# Altium schematic sheet BaseStation.SchDoc
size A2; SheetNumber: 1; SheetTotal: 1
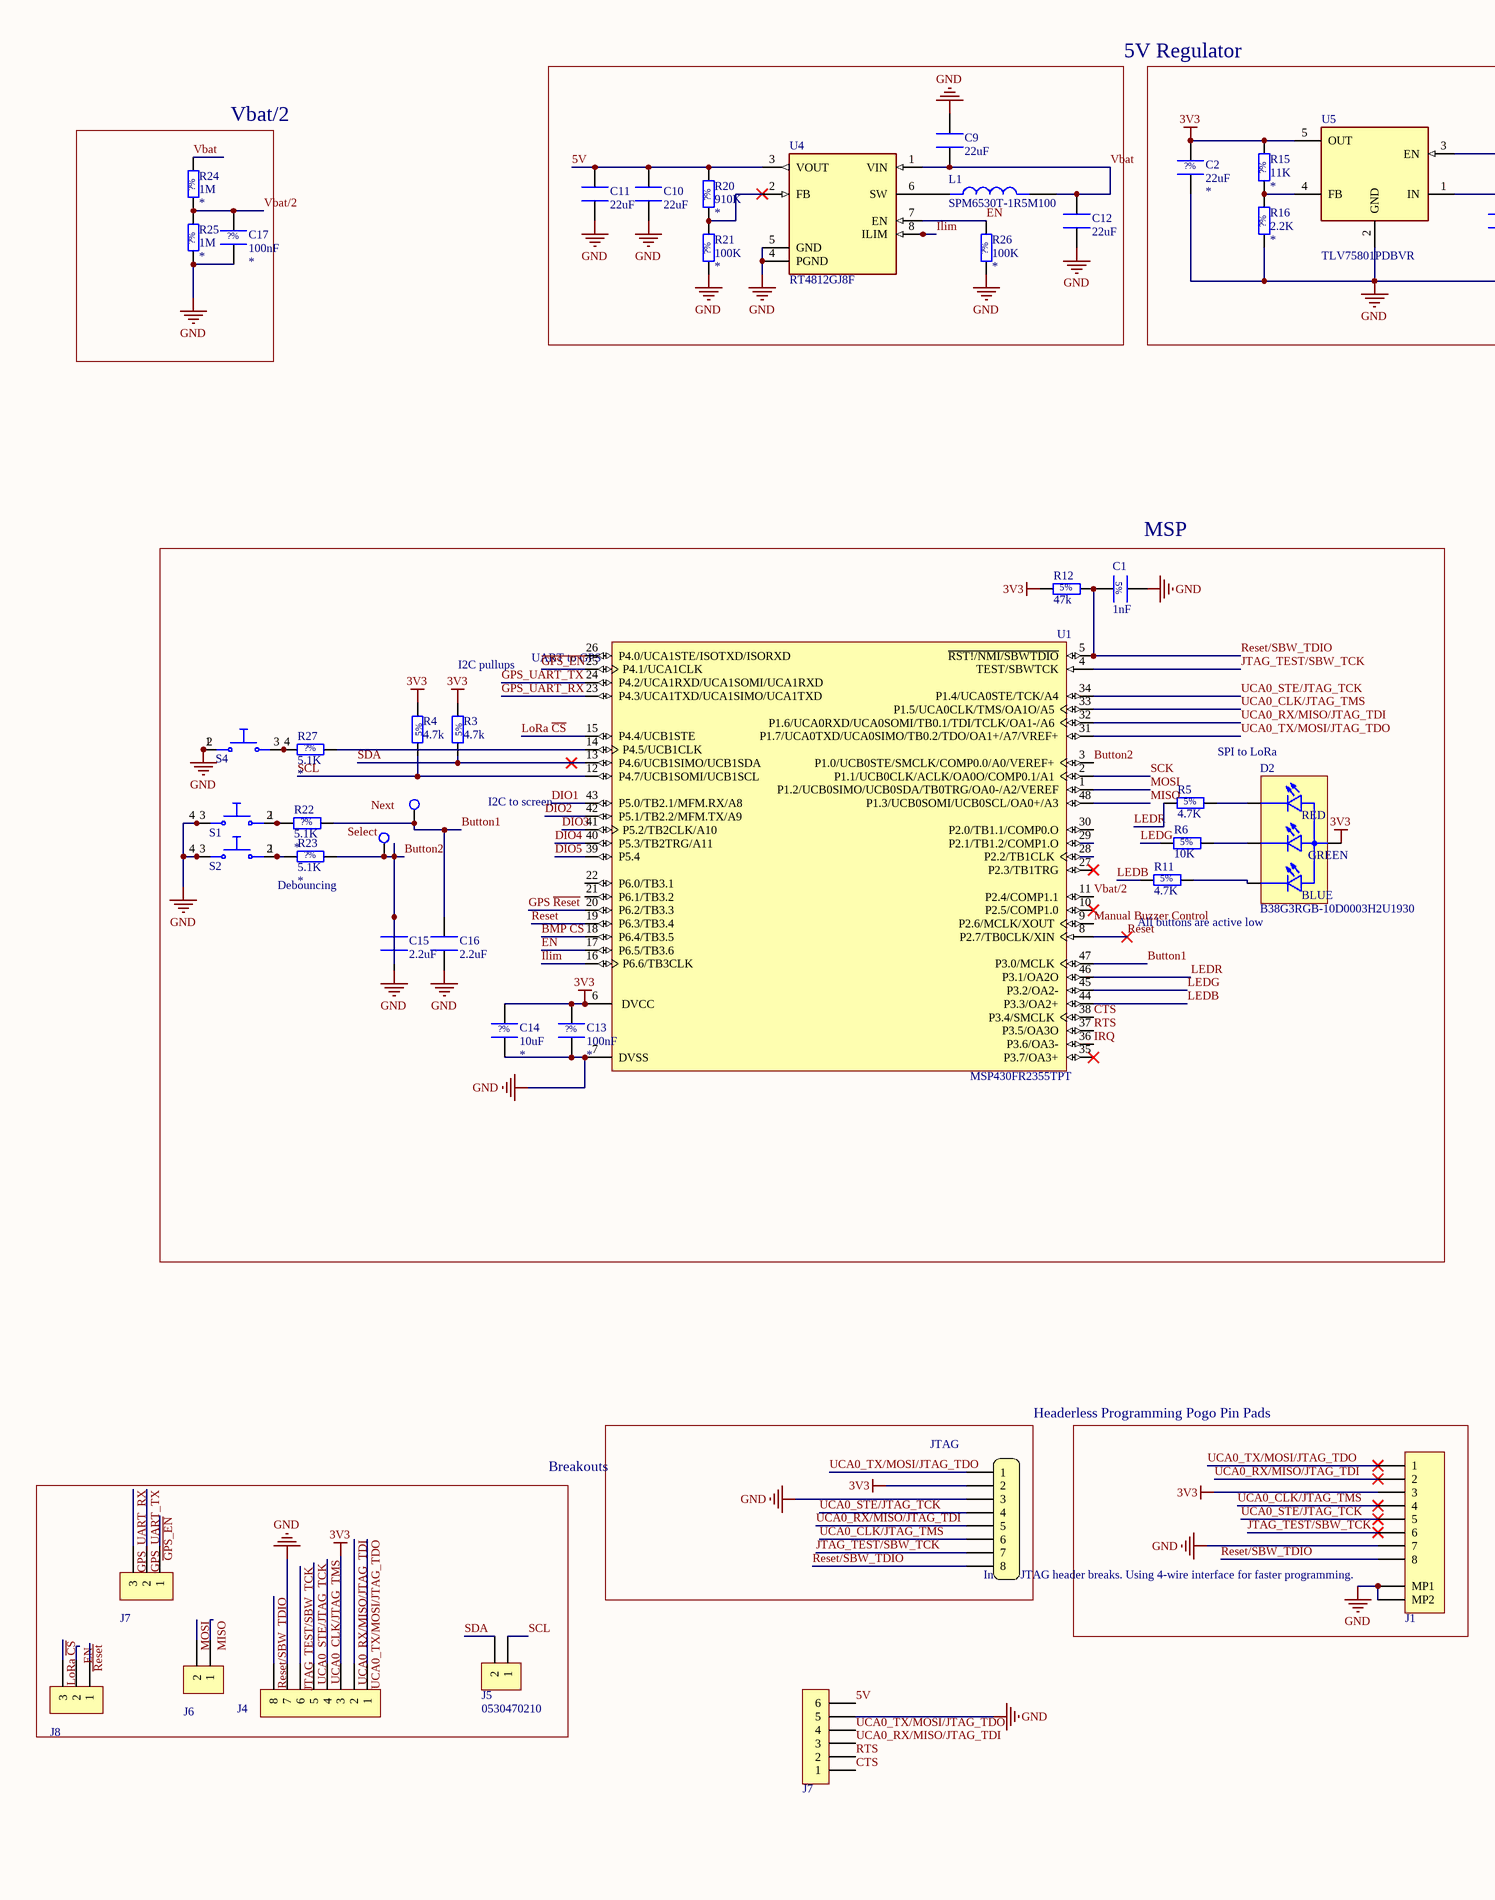
[diagram p0: BaseStation.SchDoc, left]
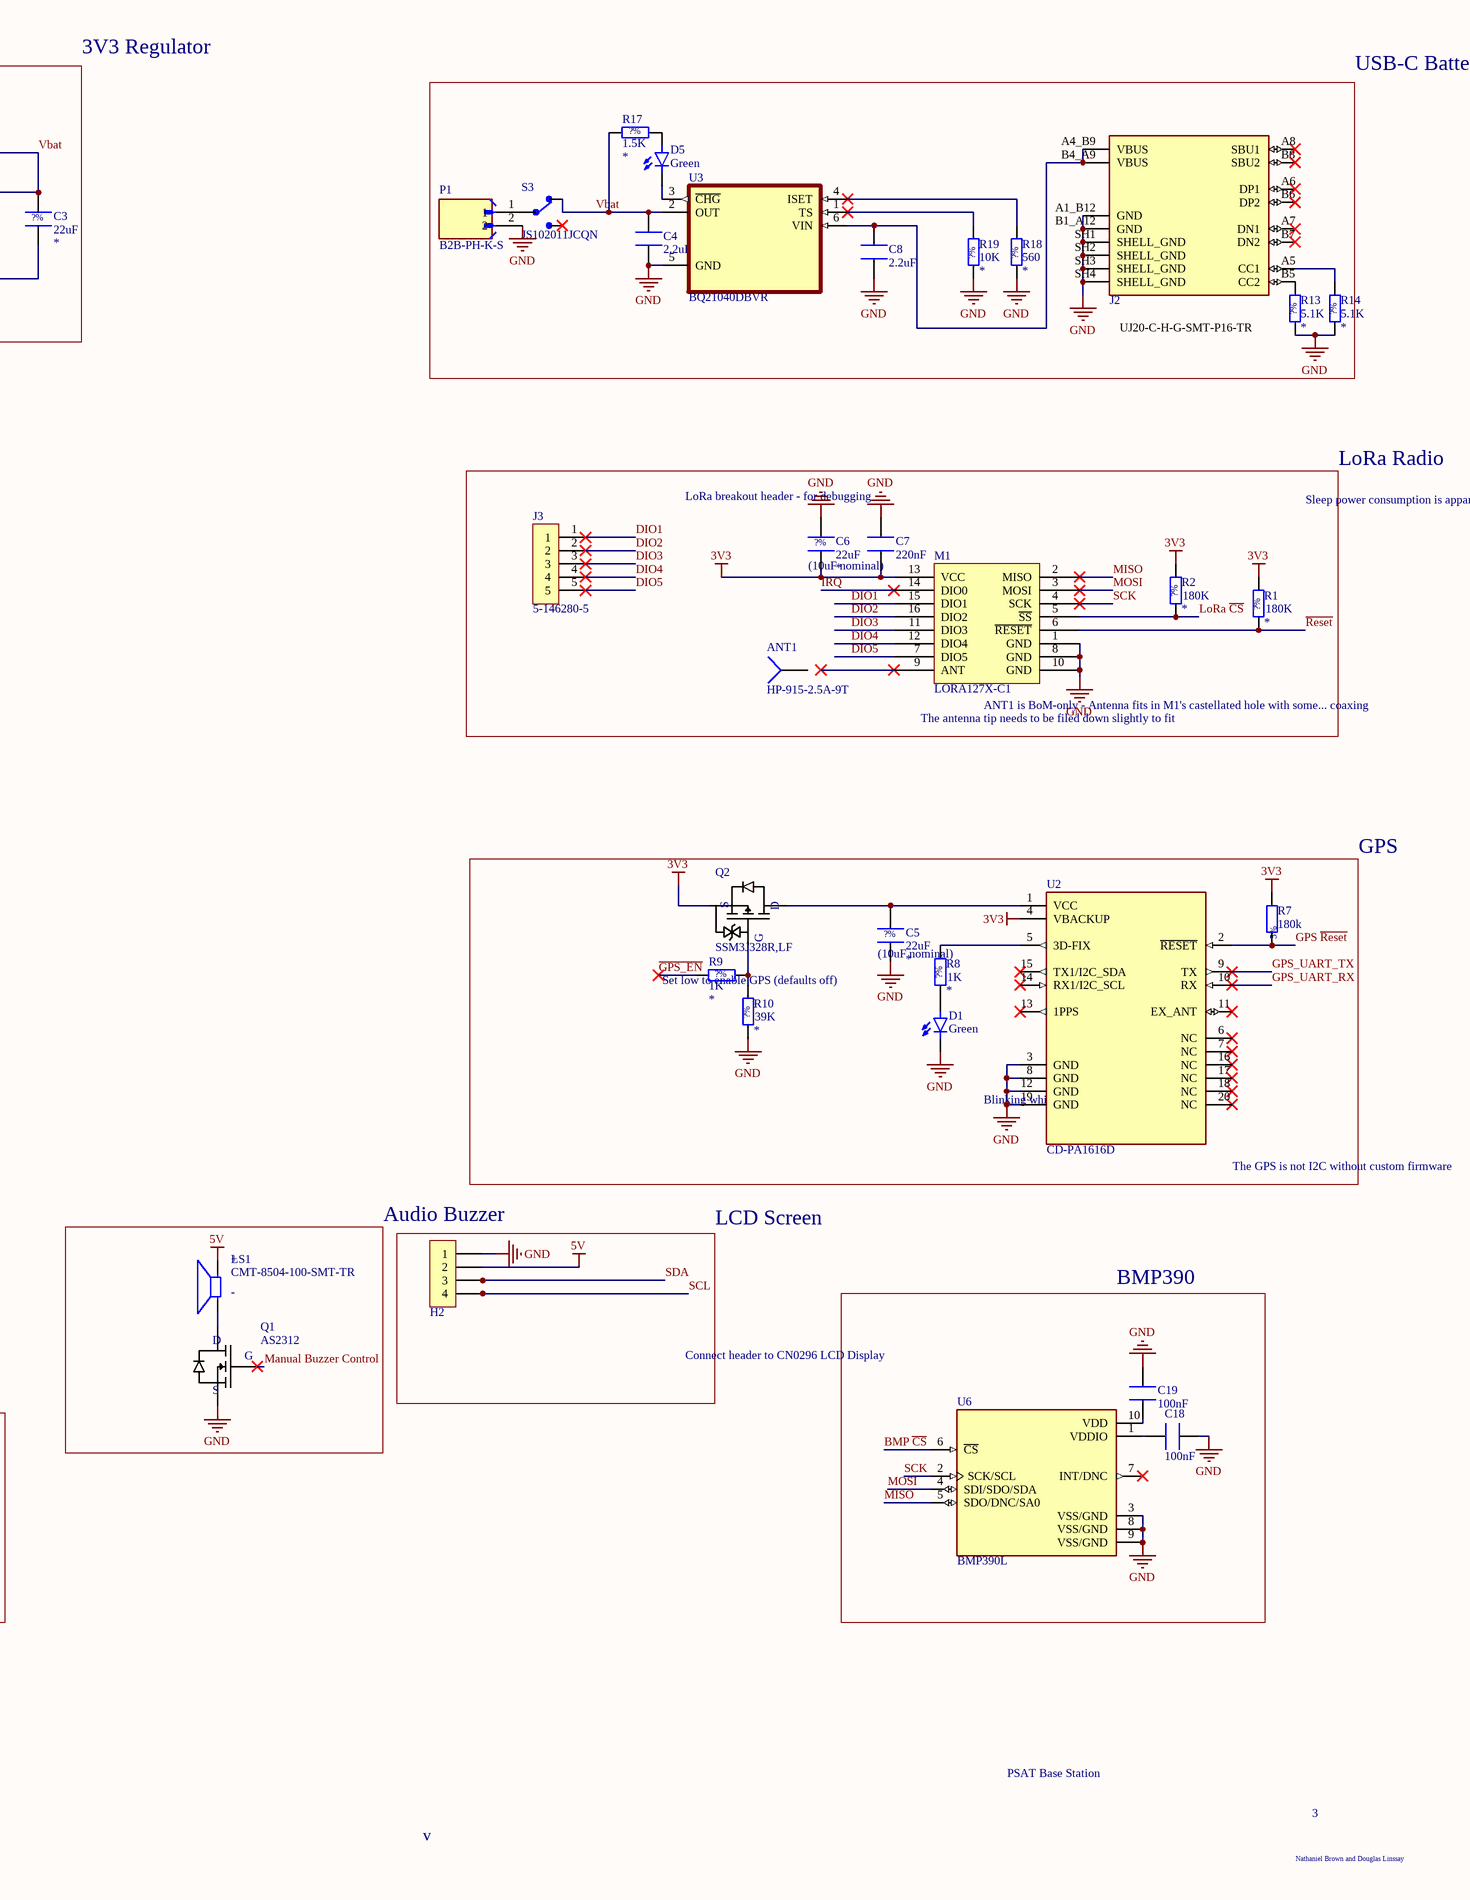
[diagram p1: BaseStation.SchDoc, right]

## Parts
(Parts that share a designator on the sheet are numbered #1, #2 ... from top to bottom, then left to right.)
ANT1  HP-915-2.5A-9T  (mechanical)
C1  1nF  [CAPACITOR_0805_2012M-70N]
C2  22uF  [CAPACITOR_0805_2012M-70N]
C3  22uF  [CAPACITOR_0805_2012M-70N]
C4  2.2uF  [CAPACITOR_0805_2012M-70N]
C5  22uF  [CAPACITOR_0805_2012M-70N]
C6  22uF  [CAPACITOR_0805_2012M-70N]
C7  220nF  [CAPACITOR_0805_2012M-70N]
C8  2.2uF  [CAPACITOR_0805_2012M-70N]
C9  22uF  [CAPACITOR_0805_2012M-70N]
C10  22uF  [CAPACITOR_0805_2012M-70N]
C11  22uF  [CAPACITOR_0805_2012M-70N]
C12  22uF  [CAPACITOR_0805_2012M-70N]
C13  100nF  [CAPACITOR_0805_2012M-70N]
C14  10uF  [CAPACITOR_0805_2012M-70N]
C15  2.2uF  [CAPACITOR_0805_2012M-70N]
C16  2.2uF  [CAPACITOR_0805_2012M-70N]
C17  100nF  [CAPACITOR_0805_2012M-70N]
C18  100nF  [CAPACITOR_0805_2012M-70N]
C19  100nF  [CAPACITOR_0805_2012M-70N]
D1  Colour: Green  [LED_0603_1608M_0.80mm]  (hidden comment: LTST-C190 Series)
D2  B38G3RGB-10D0003H2U1930  [LED_B38G3RGB-10D0003H2U1930_0606_1616M]
D5  Colour: Green  [LED_0603_1608M_0.80mm]  (hidden comment: LTST-C190 Series)
H1  Headerless Pogo Holes 8-pin  [POGO_8_PIN_HEADER]  (value not drawn)  (no BOM)
H2  Header - 2.54mm,1x4-pin  [HEADER_2.54MM_1x4PIN]  (value not drawn)  (no BOM)
J1  0532610871  [MOLEX_0532610871]  (value not drawn)
J2  UJ20-C-H-G-SMT-P16-TR  [SAMESKY_UJ20-C-H-G-SMT-P16-TR]  (value not drawn)
J3  5-146280-5  [TE_5-146280-5]
J4  0530470810  [MOLEX_0530470810]  (value not drawn)
J5  0530470210  [MOLEX_0530470210]
J6  0530470210  [MOLEX_0530470210]  (value not drawn)
J7#1  0530470310  [MOLEX_0530470310]  (value not drawn)
J7#2  0530470610  [MOLEX_0530470610]  (value not drawn)
J8  0530470310  [MOLEX_0530470310]  (value not drawn)
L1  SPM6530T-1R5M100  [IND_SPM6530T-1R5M100]
LS1  CMT-8504-100-SMT-TR  [XDCR_CMT-8504-100-SMT-TR]
M1  LORA127X-C1  [LoRa127X-C1]
NXT1  Test Pad  [Test Pad]  (value not drawn)  (no BOM)
P1  B2B-PH-K-S  [JST_B2B-PH-K-S]
Q1  AS2312  [SOT23-3N-1.15mm]
Q2  SSM3J328R,LF  [SOT23F-3-0.8mm]
R1  180K  [RESISTOR_0805_2012M-50N]
R2  180K  [RESISTOR_0805_2012M-50N]
R3  4.7k  [Resistor_0805_2012M-50N]
R4  4.7k  [Resistor_0805_2012M-50N]
R5  value 4.7K  [RESISTOR_0805_2012M-50N]  (hidden comment: 220)
R6  value 10K  [RESISTOR_0805_2012M-50N]  (hidden comment: 220)
R7  180k  [Resistor_0805_2012M-50N]
R8  1K  [RESISTOR_0805_2012M-50N]
R9  1K  [RESISTOR_0805_2012M-50N]
R10  39K  [RESISTOR_0805_2012M-50N]
R11  value 4.7K  [RESISTOR_0805_2012M-50N]  (hidden comment: 220)
R12  47k  [Resistor_0805_2012M-50N]
R13  5.1K  [RESISTOR_0805_2012M-50N]
R14  5.1K  [RESISTOR_0805_2012M-50N]
R15  11K  [RESISTOR_0805_2012M-50N]
R16  2.2K  [RESISTOR_0805_2012M-50N]
R17  1.5K  [RESISTOR_0805_2012M-50N]
R18  560  [RESISTOR_0805_2012M-50N]
R19  10K  [RESISTOR_0805_2012M-50N]
R20  910K  [RESISTOR_0805_2012M-50N]
R21  100K  [RESISTOR_0805_2012M-50N]
R22  5.1K  [RESISTOR_0805_2012M-50N]
R23  5.1K  [RESISTOR_0805_2012M-50N]
R24  1M  [RESISTOR_0805_2012M-50N]
R25  1M  [RESISTOR_0805_2012M-50N]
R26  100K  [RESISTOR_0805_2012M-50N]
R27  5.1K  [RESISTOR_0805_2012M-50N]
S1  PTS645SL43SMTR92LFS  [SW_PTS645SL43SMTR92LFS]  (value not drawn)
S2  PTS645SL43SMTR92LFS  [SW_PTS645SL43SMTR92LFS]  (value not drawn)
S3  JS102011JCQN  [SW_JS102011JCQN]
S4  PTS645SL43SMTR92LFS  [SW_PTS645SL43SMTR92LFS]  (value not drawn)
SEL1  Test Pad  [Test Pad]  (value not drawn)  (no BOM)
U1  MSP430FR2355TPT  [LQFP_PT_48_N]
U2  CD-PA1616D  [XCVR_CD-PA1616D]
U3  BQ21040DBVR  [SOT95P280X145-6N]
U4  RT4812GJ8F  [SOT65P279X100-8N]
U5  TLV75801PDBVR  [SOT23-5N-1.45mm]
U6  BMP390L  [XDCR_BMP390L]

## Blocks framed on the sheet
5V Regulator: C9-C12 L1 R20 R21 R26 U4
3V3 Regulator: C2 C3 R15 R16 U5
USB-C Battery Charger: C4 C8 D5 J2 P1 R13 R14 R17-R19 S3 U3
Vbat/2: C17 R24 R25
LoRa Radio: ANT1 C6 C7 J3 M1 R1 R2
MSP: C1 C13-C16 D2 NXT1 R3-R6 R11 R12 R22 R23 R27 S1 S2 S4 SEL1 U1
GPS: C5 D1 Q2 R7-R10 U2
Audio Buzzer: LS1 Q1
LCD Screen: H2
BMP390: C18 C19 U6
Headerless Programming Pogo Pin Pads: H1
Breakouts: J4-J6 J7#1 J8

## Nets
3V3: C2.2 C6.1 C7.1 C13.2 C14.2 D2.3(A) H1.2 J1.3 J4.3 M1.13(VCC) Q2.2(S) R1.2 R2.2 R3.2 R4.2 R7.2 R12.2 R15.2 U1.6(DVCC) U2.4(VBACKUP) U5.5(OUT)
5V: C10.2 C11.2 H2.2 J7#2.6 LS1.P R20.2 U4.3(VOUT)
GND: C1.1 C2.1 C3.1 C4.2 C5.1 C6.2 C7.2 C8.1 C9.2 C10.1 C11.1 C12.1 C13.1 C14.1 C15.1 C16.1 C17.1 C18.1 C19.1 D1.C H1.3 H2.1 J1.7 J1.MP1 J1.MP2 J2.A1_B12(GND) J2.B1_A12(GND) J2.SH1(SHELL_GND) J2.SH2(SHELL_GND) J2.SH3(SHELL_GND) J2.SH4(SHELL_GND) J4.7 J7#2.5 M1.1(GND) M1.8(GND) M1.10(GND) P1.2 Q1.2(S) R10.1 R13.1 R14.1 R16.1 R18.1 R19.1 R21.1 R25.1 R26.1 S1.3 S1.4 S2.3 S2.4 S4.1 S4.2(,_2) U1.7(DVSS) U2.3(GND) U2.8(GND) U2.12(GND) U2.19(GND) U3.5(GND) U4.4(PGND) U4.5(GND) U5.2(GND) U6.3(VSS/GND) U6.8(VSS/GND) U6.9(VSS/GND)
BMP ~{CS}: U1.18(P6.4/TB3.5) U6.6(~{CS})
Button1: C16.2 NXT1.1 R22.2 U1.47(P3.0/MCLK)
Button2: C15.2 R23.2 SEL1.1 U1.3(P1.0/UCB0STE/SMCLK/COMP0.0/A0/VEREF+)
CTS: J7#2.1 U1.38(P3.4/SMCLK)
DIO1: J3.1 M1.15(DIO1) U1.43(P5.0/TB2.1/MFM.RX/A8)
DIO2: J3.2 M1.16(DIO2) U1.42(P5.1/TB2.2/MFM.TX/A9)
DIO3: J3.3 M1.11(DIO3) U1.41(P5.2/TB2CLK/A10)
DIO4: J3.4 M1.12(DIO4) U1.40(P5.3/TB2TRG/A11)
DIO5: J3.5 M1.7(DIO5) U1.39(P5.4)
EN: J8.2 R26.2 U1.17(P6.5/TB3.6) U4.7(EN)
~{GPS_EN}: J7#1.1 R9.1 U1.25(P4.1/UCA1CLK)
GPS ~{Reset}: R7.1 U1.20(P6.2/TB3.3) U2.2(~{RESET})
GPS_UART_RX: J7#1.3 U1.23(P4.3/UCA1TXD/UCA1SIMO/UCA1TXD) U2.10(RX)
GPS_UART_TX: J7#1.2 U1.24(P4.2/UCA1RXD/UCA1SOMI/UCA1RXD) U2.9(TX)
Ilim: U1.16(P6.6/TB3CLK) U4.8(ILIM)
IRQ: M1.14(DIO0) U1.36(P3.6/OA3-)
JTAG_TEST/SBW_TCK: H1.7 J1.6 J4.6 U1.4(TEST/SBWTCK)
LEDB: R11.2 U1.44(P3.3/OA2+)
LEDG: R6.2 U1.45(P3.2/OA2-)
LEDR: R5.2 U1.46(P3.1/OA2O)
LoRa ~{CS}: J8.3 M1.5(~{SS}) R2.1 U1.15(P4.4/UCB1STE)
Manual Buzzer Control: Q1.1(G) U1.9(P2.6/MCLK/XOUT)
MISO: J6.1 M1.2(MISO) U1.48(P1.3/UCB0SOMI/UCB0SCL/OA0+/A3) U6.5(SDO/DNC/SA0)
MOSI: J6.2 M1.3(MOSI) U1.1(P1.2/UCB0SIMO/UCB0SDA/TB0TRG/OA0-/A2/VEREF) U6.4(SDI/SDO/SDA)
~{Reset}: J8.1 M1.6(~{RESET}) R1.1 U1.19(P6.3/TB3.4)
Reset: U1.8(P2.7/TB0CLK/XIN)
Reset/SBW_TDIO: C1.2 H1.8 J1.8 J4.8 R12.1 U1.5(~{RST!/NMI/SBWTDIO})
RTS: J7#2.2 U1.37(P3.5/OA3O)
SCK: M1.4(SCK) U1.2(P1.1/UCB0CLK/ACLK/OA0O/COMP0.1/A1) U6.2(SCK/SCL)
SCL: H2.4 J5.1 R4.1 U1.12(P4.7/UCB1SOMI/UCB1SCL)
SDA: H2.3 J5.2 R3.1 U1.13(P4.6/UCB1SIMO/UCB1SDA)
UCA0_CLK/JTAG_TMS: H1.6 J1.4 J4.4 U1.33(P1.5/UCA0CLK/TMS/OA1O/A5)
UCA0_RX/MISO/JTAG_TDI: H1.5 J1.2 J4.2 J7#2.3 U1.32(P1.6/UCA0RXD/UCA0SOMI/TB0.1/TDI/TCLK/OA1-/A6)
UCA0_STE/JTAG_TCK: H1.4 J1.5 J4.5 U1.34(P1.4/UCA0STE/TCK/A4)
UCA0_TX/MOSI/JTAG_TDO: H1.1 J1.1 J4.1 J7#2.4 U1.31(P1.7/UCA0TXD/UCA0SIMO/TB0.2/TDO/OA1+/A7/VREF+)
Vbat: C3.2 C4.1 C9.1 C12.2 L1.1 R17.1 R24.2 S3.1 U3.2(OUT) U4.1(VIN) U5.1(IN) U5.3(EN)
Vbat/2: C17.2 R24.1 R25.2 U1.11(P2.4/COMP1.1)
NetC5_2: C5.2 Q2.3(D) U2.1(VCC)
NetC8_2: C8.2 J2.A4_B9(VBUS) J2.B4_A9(VBUS) U3.6(VIN)
NetC18_2: C18.2 U6.1(VDDIO)
NetC19_2: C19.2 U6.10(VDD)
NetD1_A: D1.A R8.1
NetD2_1: D2.1(G_C) R6.1
NetD2_2: D2.2(B_C) R11.1
NetD2_4: D2.4(R_C) R5.1
NetD5_A: D5.A R17.2
NetD5_C: D5.C U3.3(~{CHG})
NetJ2_A5: J2.A5(CC1) R14.2
NetJ2_B5: J2.B5(CC2) R13.2
NetL1_2: L1.2 U4.6(SW)
NetLS1_N: LS1.N Q1.3(D)
NetP1_1: P1.1 S3.2
NetQ2_1: Q2.1(G) R9.2 R10.2
NetR8_2: R8.2 U2.5(3D-FIX)
NetR15_1: R15.1 R16.2 U5.4(FB)
NetR18_2: R18.2 U3.4(ISET)
NetR19_2: R19.2 U3.1(TS)
NetR20_1: R20.1 R21.2 U4.2(FB)
NetR22_1: R22.1 S1.1 S1.2(,_2)
NetR23_1: R23.1 S2.1 S2.2(,_2)
NetR27_1: R27.1 S4.3 S4.4
NetR27_2: R27.2 U1.14(P4.5/UCB1CLK)

Not connected (* = marked no-connect by the designer): ANT1 1; J2 A6(DP1)* A7(DN1)* A8(SBU1)* B6(DP2)* B7(DN2)* B8(SBU2)*; M1 9(ANT)*; S3 3*; U1 10(P2.5/COMP1.0)* 21(P6.1/TB3.2) 22(P6.0/TB3.1) 26(P4.0/UCA1STE/ISOTXD/ISORXD) 27(P2.3/TB1TRG)* 28(P2.2/TB1CLK) 29(P2.1/TB1.2/COMP1.O) 30(P2.0/TB1.1/COMP0.O) 35(P3.7/OA3+)*; U2 6(NC)* 7(NC)* 11(EX_ANT)* 13(1PPS)* 14(RX1/I2C_SCL)* 15(TX1/I2C_SDA)* 16(NC)* 17(NC)* 18(NC)* 20(NC)*; U6 7(INT/DNC)*

## Notes on the sheet
- UJ20-C-H-G-SMT-P16-TR
- (near J3) LoRa breakout header - for debugging
- (near C7) Sleep power consumption is apparently very low, so no enable needed
- (near C6) (10uF nominal)
- I2C pullups
- UART to GPS
- The antenna tip needs to be filed down slightly to fit
- ANT1 is BoM-only - Antenna fits in M1's castellated hole with some... coaxing
- (near NXT1) I2C to screen
- SPI to LoRa
- Debouncing
- All buttons are active low
- (near R9) Set low to enable GPS (defaults off)
- (near C5) (10uF nominal)
- Blinking while getting fix, off when fixed
- The GPS is not I2C without custom firmware
- Connect header to CN0296 LCD Display
- JTAG
- (near H1) In case JTAG header breaks. Using 4-wire interface for faster programming.
- PSAT Base Station
- v
- Nathaniel Brown and Douglas Linssay
- 3
- Labels drawn without touching a wire or pin: Next, Select
- (in symbol B38G3RGB-10D0003H2U1930) RED; GREEN; BLUE
- (in symbol CMT-8504-100-SMT-TR) +; -

## Library data of the parts
ANT1 = Socket: Spring Antenna; MF Part No.: HP-915-2.5A-9T
C1 = Generic Capacitor: Passive - Capacitor, Generic; Tolerance: 5%; MF Part No.: *; Value: 1nF
C2 C3 C5 C6 C13 C14 C17 = Generic Capacitor: Passive - Capacitor, Generic; Tolerance: ?%; MF Part No.: *
  C2 C3 C5 C6: Value: 22uF
  C13 C17: Value: 100nF
  C14: Value: 10uF
C4 C8 C15 C16 = C0805C225K8PACTU: Passive - Capacitor, X5R, 2.2uF Max, 10V, 0805 (2012 Metric), ±10%, -55°C ~ 85°C. 2uF @ 5V, 1.1uF @ 10V; APSS Standard Part: APSS Standard; Capacitance at Rated Voltage: 50%; Tolerance: ±10%; Temperature Coefficient: X5R; Rated Voltage: 10V; Temp Range: -55°C ~ 85°C; Supplier 1: Digikey; Supplier 1 Part No.: 399-C0805C225K8PAC7800-ND; MF Part No.: C0805C225K8PACTU; Value: 2.2uF
  C4 C8: Package: 0402
  C15 C16: Package: 0805
C7 = C0805C224K1RAC7800: Passive - Capacitor, X7R, 220nF Max, 100V, 0805 (2012 Metric), ±10%, -55°C ~ 85°C. 200nF @ 10V, 110nF @ 50V, 55nF @ 100V; APSS Standard Part: APSS Standard; Capacitance at Rated Voltage: 25%; Tolerance: ±10%; Temperature Coefficient: X7R; Rated Voltage: 100V; Temp Range: -55°C ~ 85°C; Package: 0805; Supplier 1: Digikey; Supplier 1 Part No.: 399-C0805C224K1RAC7800CT-ND; MF Part No.: C0805C224K1RAC7800; Value: 220nF
C9-C12 = GRM21BR61C226ME44L: Passive - Capacitor, X5R, 22uF Max, 16V, 0805 (2012 Metric), ±20%, -55°C ~ 85°C. 9.4uF @ 5V, 3.2uF @ 15V, 1.9uF @ 25V; APSS Standard Part: APSS Standard; Capacitance at Rated Voltage: 10%; Tolerance: ±20%; Temperature Coefficient: X5R; Rated Voltage: 16V; Temp Range: -55°C ~ 85°C; Package: 0805; Supplier 1: Digikey; Supplier 1 Part No.: 490-10747-1-ND; MF Part No.: GRM21BR61C226ME44L; Value: 22uF
C18 C19 = C0805C102J1GACTU: Passive - Capacitor, C0G, 1nF, 100V, 0805 (2012 Metric), ±5%, -55°C ~ 125°C.; APSS Standard Part: APSS Standard; Capacitance at Rated Voltage: 100%; Tolerance: ±5%; Temperature Coefficient: C0G; Rated Voltage: 100V; Temp Range: -55°C ~ 125°C; Package: 0805; Supplier 1: Digikey; Supplier 1 Part No.: 399-C0805C102J1GAC7800CT-ND; MF Part No.: C0805C102J1GACTU; Value: 100nF
D1 D5 = LTST-C190 Series: Diode - LED, 0603; MF Part No.: LTST-C190KGKT; APSS Standard Part: APSS Standard; Temp Range: -30°C ~ 85°C; Rated Voltage: 5V Reverse; Package: 0603; Supplier 1: Digikey
  D5: Supplier 1 Part No.: 160-1435-1-ND
D2 = B38G3RGB-10D0003H2U1930: Diode - LED, RGB, 2V Red, 3V Green, 3V Blue 0606 (1616 Metric); APSS Standard Part: APSS Standard; Temp Range: -40°C ~ 85°C; MF Part No.: B38G3RGB-10D0003H2U1930; Package: 0606; Supplier 1: Digikey; Supplier 1 Part No.: 3147-B38G3RGB-10D0003H2U1930CT-ND
J1 = 0532610871: Header - Picoblade 08-pin, SMT, RA; APSS Standard Part: APSS Standard; Pitch: 1.25mm; Mounting Type: Surface Mount; Orientation: Right Angle; MF Part No.: 0532610871; Pins: 8; Supplier 1: Digikey; Supplier 1 Part No.: WM7626CT-ND
J2 = UJ20-C-H-G-SMT-P16-TR: Header - USB-C 2.0 Surface Mount, Receptacle Connector 24 Position (16+8 Dummy), Right Angle, Long mounting legs; APSS Standard Part: APSS Standard; MF Part No.: USB4105-GF-A; Rated Voltage: 48VDC; Temp Range: -40°C ~ 85°C; Supplier 1: Digikey; Supplier 1 Part No.: 2073-USB4105-GF-ACT-ND
J3 = 5-146280-5: 05 MODII HDR SRST B/A .100CL; Package: None; Value: *; Price: None; MP: 5-146280-5; Availability: Unavailable
J4 = 0530470810: Header - Picoblade 08-pin, TH, STR; APSS Standard Part: APSS Standard; Pitch: 1.25mm; Mounting Type: Through-hole; Orientation: Straight; MF Part No.: 0530470810; Pins: 8; Supplier 1: Digikey; Supplier 1 Part No.: WM1737-ND
J5 J6 = 0530470210: Header - Picoblade 02-pin, TH, STR; APSS Standard Part: APSS Standard; Pitch: 1.25mm; Mounting Type: Through-hole; Orientation: Straight; Pins: 2; Supplier 1: Digikey; Supplier 1 Part No.: WM1731-ND; MF Part No.: 0530470210
J7#1 J8 = 0530470310: Header - Picoblade 03-pin, TH, STR; APSS Standard Part: APSS Standard; Pitch: 1.25mm; Mounting Type: Through-hole; Orientation: Straight; MF Part No.: 0530470310; Pins: 3; Supplier 1: Digikey; Supplier 1 Part No.: WM1732-ND
J7#2 = 0530470610: Header - Picoblade 06-pin, TH, STR; APSS Standard Part: APSS Standard; Pitch: 1.25mm; Mounting Type: Through-hole; Orientation: Straight; MF Part No.: 0530470610; Pins: 6; Supplier 1: Digikey; Supplier 1 Part No.: WM1735-ND
L1 = SPM6530T-1R5M100: 1.5 ÂµH Shielded Drum Core, Wirewound Inductor 11 A 10.67mOhm Max Nonstandard; MF: TDK; Value: *; Digi-Key_Part_Number: 445-3881-2-ND; Check_prices: https://www.snapeda.com/parts/SPM6530T-1R5M100/TDK/view-part/?ref=eda; Package: NON STANDARD-2 TDK; SnapEDA_Link: https://www.snapeda.com/parts/SPM6530T-1R5M100/TDK/view-part/?ref=snap; MP: SPM6530T-1R5M100; Purchase-URL: https://pricing.snapeda.com/search/part/SPM6530T-1R5M100/?ref=eda
LS1 = CMT-8504-100-SMT-TR: 8.5 mm, 5 Vo-p, 100 dB, Surface Mount (SMT), Magnetic Audio Transducer Buzzer; MF Part No.: CMT-8504-100-SMT-TR
P1 = B2B-PH-K-S: Connector Header Through Hole 2 position 0.079 (2.00mm); MF: JST Sales America Inc.; SnapEDA_Link: https://www.snapeda.com/parts/B2B-PH-K-S/JST/view-part/?ref=snap; Package: None; Value: *; MP: B2B-PH-K-S; Check_prices: https://www.snapeda.com/parts/B2B-PH-K-S/JST/view-part/?ref=eda
Q1 = AS2312: Transistor - MOSFET, N-Channel AS2312; APSS Standard Part: APSS Standard; Temp Range: 0°C ~ 150°C (TJ); Rated Voltage: 20 Vds; Power: 1.2W; Package: SOT23-3; MF Part No.: AS2312; Supplier 1: Digikey; Supplier 1 Part No.: 4530-AS2312CT-ND
Q2 = SSM3J328R,LF: Transistor - MOSFET, P-Channel SSM3J328R,LF; APSS Standard Part: APSS Standard; Temp Range: 0°C ~ 150°C (TJ); Rated Voltage: 20 Vds; Power: 1W; MF Part No.: SSM3J328R,LF; Package: SOT23-3; Supplier 1: Digikey; Supplier 1 Part No.: SSM3J328RLFCT-ND
R1 R2 R8-R10 R13-R27 = Generic Resistor: Passive - Resistor, Generic; Tolerance: ?%; MF Part No.: *
  R1 R2: Value: 180K
  R8 R9: Value: 1K
  R10: Value: 39K
  R13 R14 R22 R23 R27: Value: 5.1K
  R15: Value: 11K
  R16: Value: 2.2K
  R17: Value: 1.5K
  R18: Value: 560
  R19: Value: 10K
  R20: Value: 910K
  R21 R26: Value: 100K
  R24 R25: Value: 1M
R3-R6 R11 R12 = Generic Resistor: Passive - Resistor, Generic; Tolerance: 5%
  R3 R4: MF Part No.: *; Value: 4.7k
  R5 R6 R11: MF Part No.: 220
  R12: MF Part No.: *; Value: 47k
R7 = RMCF0805JT Series: Passive - Resistor Series, 0805, 5%, 100m - 22M, E24, 0.063W, 1/16W, ±200ppm/°C, -55°C ~ 155°C, 0805 (2012 Metric); MF Part No.: RMCF0805JT180K; APSS Standard Part: APSS Standard; Power: 1/8W; Value Range: 100m ~ 22M; Rated Voltage: 150V; Tolerance: 5%; E Series: E24; Temp Range: -55°C ~ 155°C; Supplier 1: Digikey; Package: 0805; Temperature Coefficient: ±200ppm/°C; Value: 180k
S1 S2 = PTS645SL43SMTR92LFS: Switch - SPST, Momentary, Normally Open, 50mA @ 12VDC; APSS Standard Part: APSS Standard; Rated Voltage: 250V AC; Temp Range: -40°C ~ 85°C; MF Part No.: SW_PTS645SL43SMTR92LFS; Mounting Type: Surface Mount; Supplier 1: Digikey; Supplier 1 Part No.: CKN10880CT-ND
S3 = JS102011JCQN: Switch - Slide, SPDT, Straight, Break Before Make, 300mA, 6V; APSS Standard Part: APSS Standard; Temp Range: -40°C ~ 85°C; MF Part No.: JS102011JCQN; Mounting Type: Through-hole; Orientation: Straight; Rated Voltage: 6V; Supplier 1: Digikey; Supplier 1 Part No.: CKN10721CT-ND
S4 = PTS645SL43SMTR92LFS: Switch - Tact, SPST, Momentary, Normally Open, 50mA @ 12VDC; APSS Standard Part: APSS Standard; Rated Voltage: 250V AC; Temp Range: -40°C ~ 85°C; MF Part No.: SW_PTS645SL43SMTR92LFS; Mounting Type: Surface Mount; Supplier 1: Digikey; Supplier 1 Part No.: CKN10880CT-ND
U1 = MSP430FR2355TPT: IC - Microcontroller, 24MHz, 32KB FRAM, Op-Amps/PGAs, 12-bit DACs, 12-bit ADC, 48-LQFP, -40 to 105C; APSS Standard Part: APSS Standard; Temp Range: -40°C ~ 105°C; Rated Voltage: 3.6V; MF Part No.: MSP430FR2355TPT; Package: LQFP-48; Supplier 1: Digikey; Supplier 1 Part No.: 296-50260-ND
U2 = CD-PA1616D: CD-PA1616DGNSS patch antenna module; MF: CD Top; Package: Package; Price: None; Value: *; Check_prices: https://www.snapeda.com/parts/CD-PA1616D/CD+Top/view-part/?ref=eda; SnapEDA_Link: https://www.snapeda.com/parts/CD-PA1616D/CD+Top/view-part/?ref=snap; MP: CD-PA1616D; Availability: Not in stock
U3 = BQ21040DBVR: 1-cell, 0.8-A Li-ion and Li-polymer battery charger; MF: Texas Instruments; SnapEDA_Link: https://www.snapeda.com/parts/BQ21040DBVR/Texas+Instruments/view-part/?ref=snap; Package: SOT-23-6 Texas Instruments; Value: *; MP: BQ21040DBVR; Check_prices: https://www.snapeda.com/parts/BQ21040DBVR/Texas+Instruments/view-part/?ref=eda
U4 = RT4812GJ8F: Boost Switching Regulator IC Positive Adjustable 1.8V 1 Output 2A SOT-23-8 Thin, TSOT-23-8; MF: Richtek USA; Value: *; Availability: Unavailable; Price: None; SnapEDA_Link: https://www.snapeda.com/parts/RT4812GJ8F/Richtek%20USA%20Inc./view-part/699858/?ref=snap; DigiKey-Purchase-URL: https://snapeda.com/shop?store=DigiKey&id=699858; Package: TSOT-23 Richtek; MP: RT4812GJ8F
U5 = TLV75801PDBVR: IC - Regulator, LDO, 500 mA, Low Quiescent Current, SOT23-5 / Vout=Vfeedback *(1+(R1/R2)) / where the feedback voltage is 0.55V; APSS Standard Part: APSS Standard; Temp Range: -40°C ~ 125°C (TJ); Rated Voltage: 6V; MF Part No.: TLV75801PDBVR; Package: SOT-23-5; Supplier 1: Digikey; Supplier 1 Part No.: 296-TLV75801PDBVRCT-ND
U6 = BMP390L: Pressure Sensor 4.35PSI ~ 18.13PSI (30kPa ~ 125kPa) Absolute - - 10-WFLGA; MF: Bosch Sensortec; SnapEDA_Link: https://www.snapeda.com/parts/BMP390L/Bosch+Sensortec/view-part/?ref=snap; Package: None; Value: *; MP: BMP390L; Check_prices: https://www.snapeda.com/parts/BMP390L/Bosch+Sensortec/view-part/?ref=eda